# EAGLE schematic BEP33_2panel_v2b_DESKTOP-T8KKGMJ_Mai-19-014526-2018_Conflict (EAGLE 7.7.0)
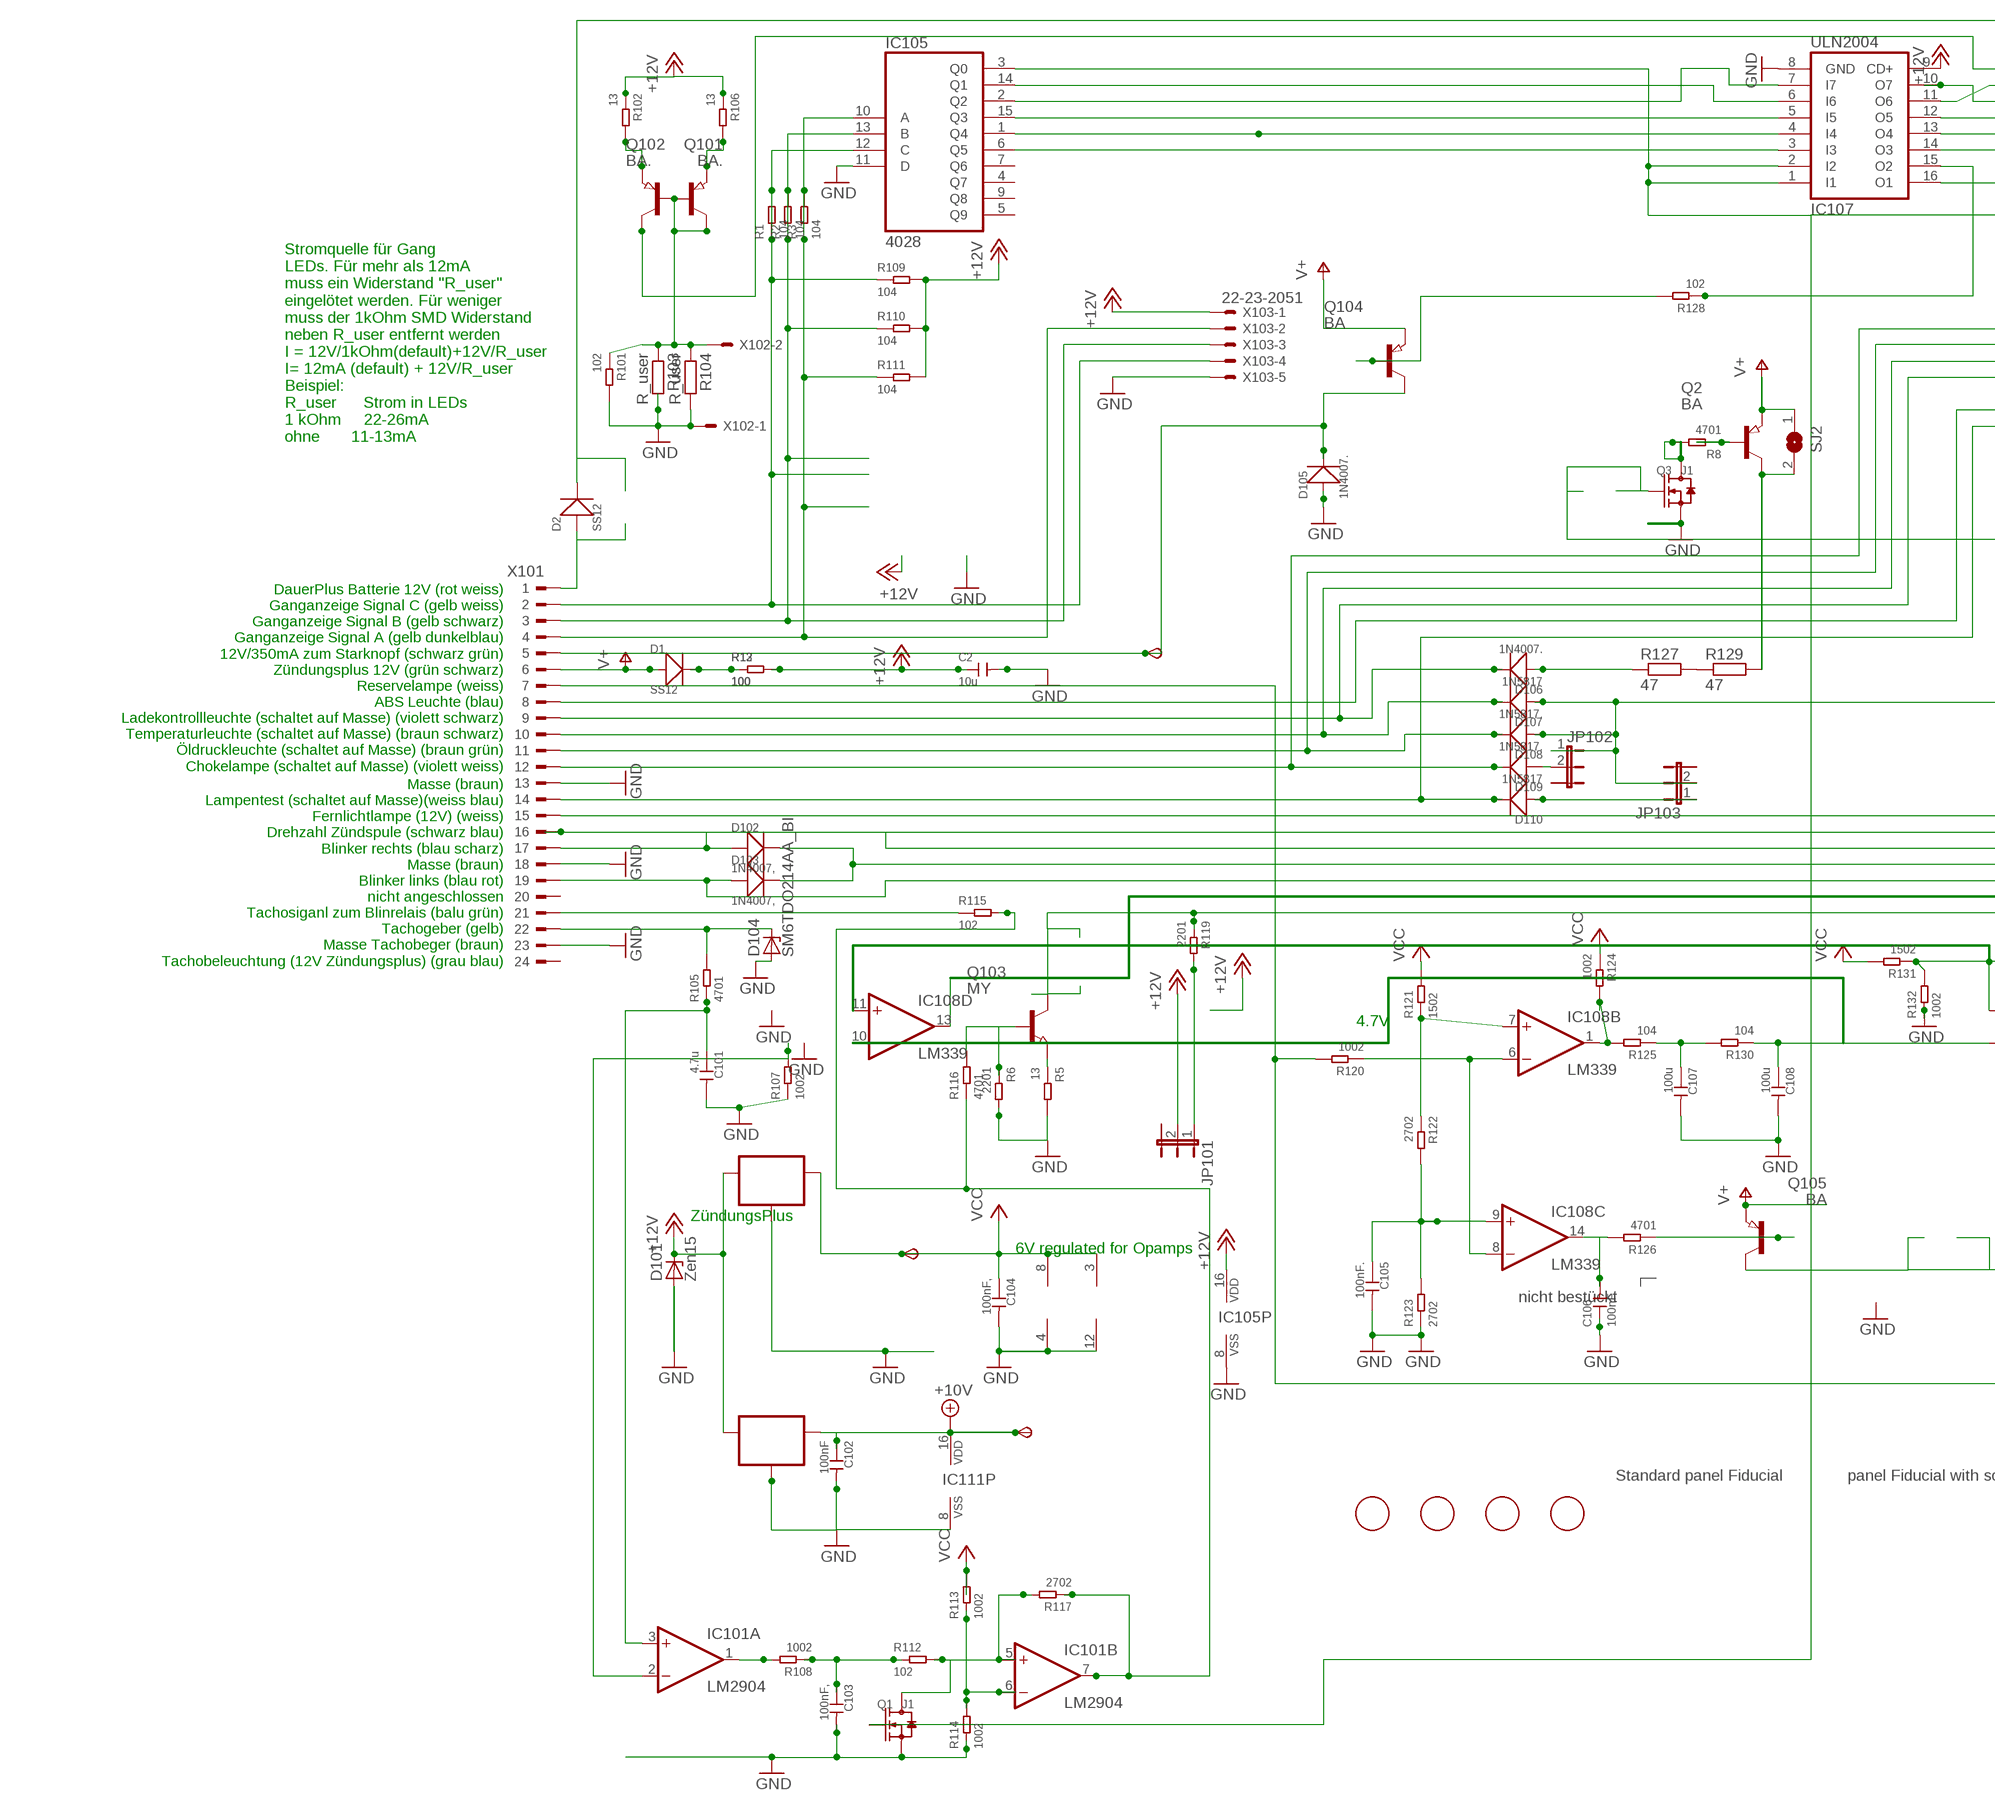
[diagram p0: schematic, sheet 1, part 1 of 2]
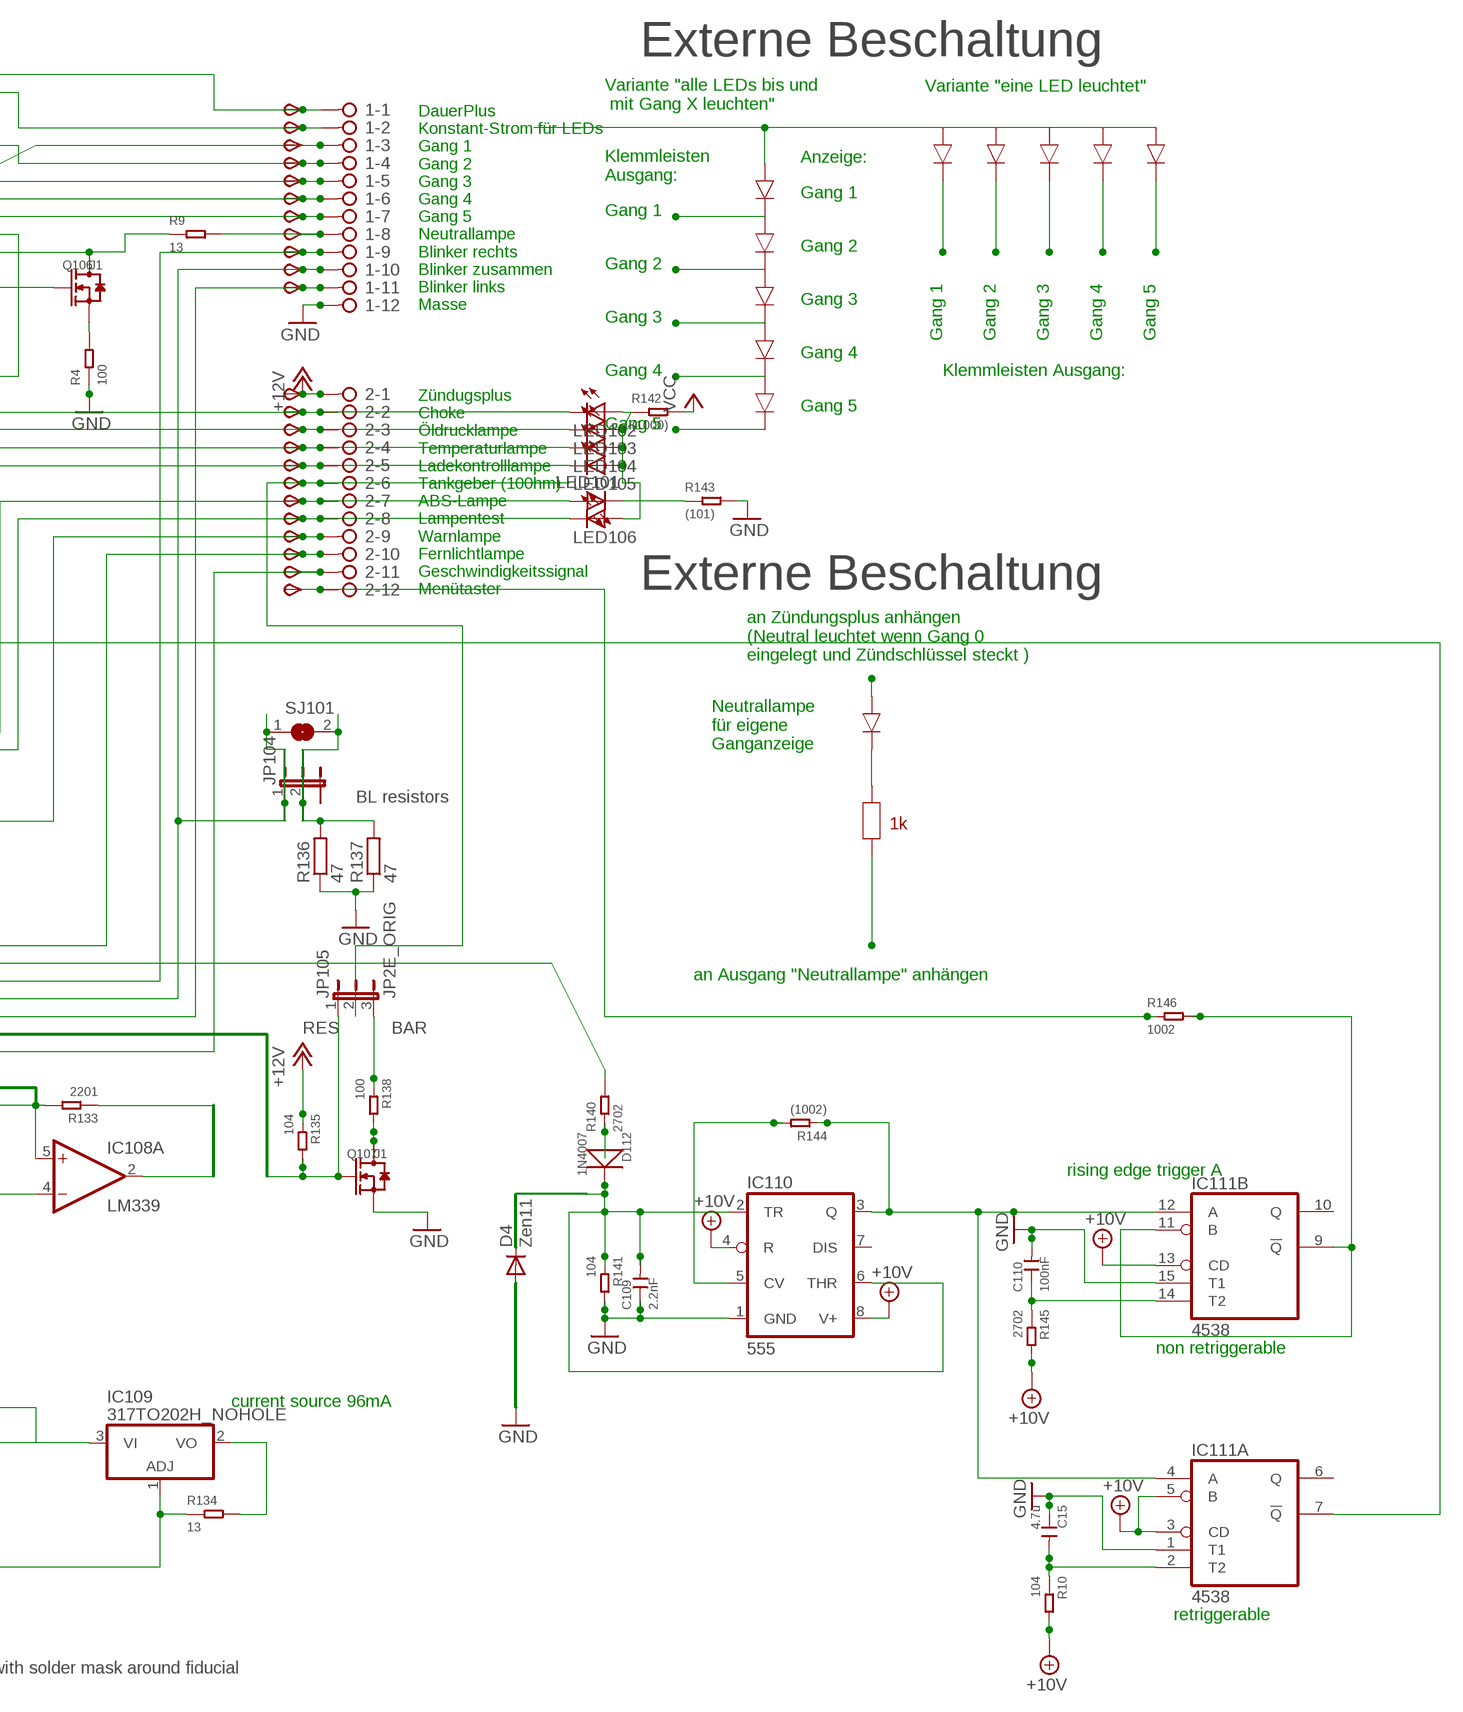
[diagram p1: schematic, sheet 1, part 2 of 2]

## Parts
1  2081-1132  [12-PIN]
2  2081-1132  [12-PIN]
6V  TPSB2.0  [B2.0]
10V  TPSB2.0  [B2.0]
C2  10u  CERAMIC-100UF-6.3V-20%-X5R(1206)  [C1206]
C15  4.7u  CERAMIC-4.7UF-25V-10%-X5R(0805)  [C0805]
C101  4.7u  CERAMIC-4.7UF-25V-10%-X5R(0805)  [C0805]
C102  100nF  CERAMIC-100NF-50V-10%-X7R(0805)  [C0805]
C103  100nF,  CERAMIC-100NF-50V-10%-X7R(0805)  [C0805]
C104  100nF,  CERAMIC-100NF-50V-10%-X7R(0805)  [C0805]
C105  100nF.  CERAMIC-100NF-50V-10%-X7R(0805)  [C0805]
C106  100nF.  CERAMIC-100NF-50V-10%-X7R(0805)  [C0805]
C107  100u  CERAMIC-100UF-6.3V-20%-X5R(1206)  [C1206]
C108  100u  CERAMIC-100UF-6.3V-20%-X5R(1206)  [C1206]
C109  2.2nF  CERAMIC-100NF-50V-10%-X7R(0805)  [C0805]
C110  100nF  CERAMIC-100NF-50V-10%-X7R(0805)  [C0805]
D1  SS12  DIODE-GEN-PURPOSE-1KV-1A(DO-214AC)DO-214AC/1206  [DO-214AC_SLIM]
D2  SS12  DIODE-GEN-PURPOSE-1KV-1A(DO-214AC)DO-214AC/1206  [DO-214AC_SLIM]
D4  Zen11  CGRM4001-G  [SOD-123_MINI-SMA]
D101  Zen15  SM6T  [DO214AA]
D102  1N4007,  DIODE-GEN-PURPOSE-1KV-1A(DO-214AC)  [DO-214AC]
D103  1N4007,  DIODE-GEN-PURPOSE-1KV-1A(DO-214AC)  [DO-214AC]
D104  SM6TDO214AA_BI  [DO214AA_BI]
D105  1N4007.  DIODE-GEN-PURPOSE-1KV-1A(DO-214AC)  [DO-214AC]
D106  1N4007.  DIODE-GEN-PURPOSE-1KV-1A(DO-214AC)  [DO-214AC]
D107  1N5817  DIODE-GEN-PURPOSE-1KV-1A(DO-214AC)DO-214AC/1206  [DO-214AC_SLIM]
D108  1N5817.  DIODE-GEN-PURPOSE-1KV-1A(DO-214AC)DO-214AC/1206  [DO-214AC_SLIM]
D109  1N5817.  DIODE-GEN-PURPOSE-1KV-1A(DO-214AC)DO-214AC/1206  [DO-214AC_SLIM]
D110  1N5817  DIODE-GEN-PURPOSE-1KV-1A(DO-214AC)DO-214AC/1206  [DO-214AC_SLIM]
D112  1N4007  DIODE-GEN-PURPOSE-1KV-1A(DO-214AC)  [DO-214AC]
FID101  FIDUCIAL  [FIDUCIAL_1MM]
FID102  FIDUCIAL  [FIDUCIAL_1MM]
FID103  FIDUCIAL  [FIDUCIAL_1MM]
FID104  FIDUCIAL  [FIDUCIAL_1MM]
IC101  LM2904  LM358D  [SO08]
IC102  78L06  78LXXSOT89_ROUND  [SOT89_ROUND]
IC104  78L10  78LXXSOT89_ROUND  [SOT89_ROUND]
IC105  4028  4028D  [SO16]
IC107  ULN2004  ULN2004AD  [SO16]
IC108  LM339  LM339D  [SO14]
IC109  317TO202H_NOHOLE  [TO220H_NOHOLE]
IC110  555  NE555D  [SO08]
IC111  4538  4538D  [SO16]
JP101  JP2EJP2_SMALLPADS  [JP2_SMALLPADS]
JP102  JP2EJP2_SMALLPADS  [JP2_SMALLPADS]
JP103  JP2EJP2_SMALLPADS  [JP2_SMALLPADS]
JP104  JP2EJP2_SMALLPADS  [JP2_SMALLPADS]
JP105  JP2E_ORIG  [JP2_ORIG_SMALLPADS]
LED101  LEDLD260  [LD260]
LED102  LEDLD260  [LD260]
LED103  LEDLD260  [LD260]
LED104  LEDLD260  [LD260]
LED105  LEDLD260  [LD260]
LED106  LEDLD260  [LD260]
Q1  J1  SMD-MOSFET-N-CH-50V-200MA-BSS138W-7-F(SOT-23)  [SOT-23]
Q2  BA  PNP-TRANSISTOR_SOT89  [SOT89]
Q3  J1  SMD-MOSFET-N-CH-50V-200MA-BSS138W-7-F(SOT-23)  [SOT-23]
Q101  BA.  PNP-TRANSISTOR_SOT89  [SOT89]
Q102  BA.  PNP-TRANSISTOR_SOT89  [SOT89]
Q103  MY  NPN-TRANSISTOR_SOT89  [SOT89]
Q104  BA  PNP-TRANSISTOR_SOT89  [SOT89]
Q105  BA  PNP-TRANSISTOR_SOT89  [SOT89]
Q106  J1  SMD-MOSFET-N-CH-50V-200MA-BSS138W-7-F(SOT-23)  [SOT-23]
Q107  J1  SMD-MOSFET-N-CH-50V-200MA-BSS138W-7-F(SOT-23)  [SOT-23]
R1  104  SMD-RES-10K-1%-1/8W(0805)  [R0805]
R2  104  SMD-RES-10K-1%-1/8W(0805)  [R0805]
R3  104  SMD-RES-10K-1%-1/8W(0805)  [R0805]
R4  100  SMD-RES-220R-5%-1/8W(0805)  [R0805]
R5  13  SMD-RES-13R-5%-1/4W(1206)  [R1206]
R6  2201  SMD-RES-1K-5%-1/8W(0805)  [R0805]
R8  4701  SMD-RES-4.7K-5%-1/8W(0805)  [R0805]
R9  13  SMD-RES-13R-5%-1/4W(1206)  [R1206]
R10  104  SMD-RES-4.7K-5%-1/8W(0805)  [R0805]
R12  100  SMD-RES-2.2K-5%-1/8W(0805)  [R0805]
R13  100  SMD-RES-2.2K-5%-1/8W(0805)  [R0805]
R101  102  SMD-RES-1K-5%-1/8W(0805)  [R0805]
R102  13  SMD-RES-13R-5%-1/4W(1206)  [R1206]
R103  R_user  R-EU_R0805  [R0805]
R104  R_user  R-EU_R0805  [R0805]
R105  4701  SMD-RES-4.7K-5%-1/8W(0805)  [R0805]
R106  13  SMD-RES-13R-5%-1/4W(1206)  [R1206]
R107  1002  SMD-RES-10K-1%-1/8W(0805)  [R0805]
R108  1002  SMD-RES-10K-1%-1/8W(0805)  [R0805]
R109  104  SMD-RES-10K-1%-1/8W(0805)  [R0805]
R110  104  SMD-RES-10K-1%-1/8W(0805)  [R0805]
R111  104  SMD-RES-10K-1%-1/8W(0805)  [R0805]
R112  102  SMD-RES-1K-5%-1/8W(0805)  [R0805]
R113  1002  SMD-RES-1K-5%-1/8W(0805)  [R0805]
R114  1002  SMD-RES-1K-5%-1/8W(0805)  [R0805]
R115  102  SMD-RES-220R-5%-1/8W(0805)  [R0805]
R116  4701  SMD-RES-4.7K-5%-1/8W(0805)  [R0805]
R117  2702  SMD-RES-4.7K-5%-1/8W(0805)  [R0805]
R119  2201  SMD-RES-2.2K-5%-1/8W(0805)  [R0805]
R120  1002  SMD-RES-10K-1%-1/8W(0805)  [R0805]
R121  1502  SMD-RES-10K-1%-1/8W(0805)  [R0805]
R122  2702  SMD-RES-4.7K-5%-1/8W(0805)  [R0805]
R123  2702  SMD-RES-4.7K-5%-1/8W(0805)  [R0805]
R124  1002  SMD-RES-10K-1%-1/8W(0805)  [R0805]
R125  104  SMD-RES-10K-1%-1/8W(0805)  [R0805]
R126  4701  SMD-RES-4.7K-5%-1/8W(0805)  [R0805]
R127  47  R-EU_V235/17_1MM  [V235/17_1MM]
R128  102  SMD-RES-1K-5%-1/8W(0805)  [R0805]
R129  47  R-EU_V235/17_1MM  [V235/17_1MM]
R130  104  SMD-RES-10K-1%-1/8W(0805)  [R0805]
R131  1502  SMD-RES-10K-1%-1/8W(0805)  [R0805]
R132  1002  SMD-RES-10K-1%-1/8W(0805)  [R0805]
R133  2201  SMD-RES-2.2K-5%-1/8W(0805)  [R0805]
R134  13  SMD-RES-13R-5%-1/4W(1206)  [R1206]
R135  104  SMD-RES-10K-1%-1/8W(0805)  [R0805]
R136  47  R-EU_V235/17_1MM  [V235/17_1MM]
R137  47  R-EU_V235/17_1MM  [V235/17_1MM]
R138  100  SMD-RES-2.2K-5%-1/8W(0805)  [R0805]
R140  2702  SMD-RES-10K-1%-1/8W(0805)  [R0805]
R141  104  SMD-RES-10K-1%-1/8W(0805)  [R0805]
R142  (1000)  SMD-RES-100R-5%-1/8W(0805)  [R0805]
R143  (101)  SMD-RES-100R-5%-1/8W(0805)  [R0805]
R144  (1002)  SMD-RES-10K-1%-1/8W(0805)  [R0805]
R145  2702  SMD-RES-4.7K-5%-1/8W(0805)  [R0805]
R146  1002  SMD-RES-4.7K-5%-1/8W(0805)  [R0805]
SJ2  SJ  [SJ]
SJ101  SJ  [SJ]
START  TPSB2.0  [B2.0]
TP1  TPSB2.0  [B2.0]
TP2  TPSB2.0  [B2.0]
TP3  TPSB2.0  [B2.0]
TP4  TPSB2.0  [B2.0]
TP5  TPSB2.0  [B2.0]
TP6  TPSB2.0  [B2.0]
TP7  TPSB2.0  [B2.0]
TP8  TPSB2.0  [B2.0]
TP9  TPSB2.0  [B2.0]
TP10  TPSB2.0  [B2.0]
TP11  TPSB2.0  [B2.0]
TP12  TPSB2.0  [B2.0]
TP13  TPSB2.0  [B2.0]
TP16  TPSB2.0  [B2.0]
TP17  TPSB2.0  [B2.0]
TP18  TPSB2.0  [B2.0]
TP19  TPSB2.0  [B2.0]
TP21  TPSB2.0  [B2.0]
TP22  TPSB2.0  [B2.0]
TP23  TPSB2.0  [B2.0]
TP24  TPSB1,27  [B1,27]
TP25  TPSB2.0  [B2.0]
TP26  TPSB2.0  [B2.0]
X101  CON_BMWV2  [24-PIN_V2]
X102  22-23-2021  [22-23-2021]
X103  22-23-2051  [22-23-2051]

## Nets
+10V: 10V.TP(PP) C102.1 IC104.1(OUT) IC110.4(R) IC110.8(V+) IC111.3(A:CD) IC111.5(A:B) IC111.13(B:CD) IC111.16(P:VDD) R10.2 R145.2
+12V: 2.1 C2.1 D101.C IC102.3(IN) IC104.3(IN) IC105.16(VDD) IC107.9(CD+) JP101.2 R12.2 R13.2 R102.1 R106.1 R109.2 R110.2 R111.2 R135.1 TP12.TP(PP) X103.1
+12V1: 2.11 Q103.2(C) R119.1 TP26.TP(PP)
GND: 1.12 C2.2 C15.1 C101.2 C102.2 C103.2 C104.2 C105.2 C106.1 C107.2 C108.2 C109.1 C110.2 D4.A D101.A D104.A D105.1(+) IC101.4(P:V-) IC102.2(GND) IC102.2@1(GND) IC104.2(GND) IC104.2@1(GND) IC105.8(VSS) IC105.11(D) IC107.8(GND) IC108.12(P:GND) IC110.1(GND) IC111.1(A:T1) IC111.8(P:VSS) IC111.15(B:T1) Q1.2(S) Q3.2(S) Q107.2(S) R4.1 R5.2 R6.2 R101.2 R103.2 R104.2 R107.1 R114.1 R123.1 R132.1 R136.1 R137.1 R141.2 R143.2 X101.13 X101.18 X101.23 X102.1 X103.5
N$1: 2.9 D107.1(+) D108.1(+) JP102.1 JP103.2 TP24.TP(PP)
N$2: IC105.10(A) R3.1 R3.2 R111.1 X101.4 X103.2
N$3: IC105.13(B) R2.1 R2.2 R110.1 X101.3 X103.3
N$4: 2.7 LED101.A TP22.TP(PP) X101.8
N$5: Q101.3(E) R102.2
N$6: Q2.1(B) R8.1
N$7: IC101.2(A:-IN) R107.2
N$8: R127.2 R129.1
N$9: Q102.3(E) R106.2
N$11: D105.2(-) Q104.2(C) START.TP(PP) X101.5
N$12: 2.2 D109.2(-) LED102.K(C) TP16.TP(PP) X101.12
N$13: 2.3 D108.2(-) LED103.K(C) TP17.TP(PP) X101.11
N$14: 2.4 D107.2(-) LED104.K(C) TP18.TP(PP) X101.10
N$15: IC109.3(VI) Q105.2(C)
N$16: IC108.6(B:-IN) IC108.8(C:-IN) R120.1
N$17: IC105.12(C) R1.1 R1.2 R109.1 X101.2 X103.4
N$18: IC105.15(Q3) IC107.5(I5)
N$19: 2.8 D110.2(-) LED106.K(C) TP23.TP(PP) X101.14
N$20: 1.9 D102.1(+) TP9.TP(PP) X101.17
N$21: 1.11 D103.1(+) TP11.TP(PP) X101.19
N$22: IC111.9(B:!Q) IC111.11(B:B) R146.2
N$23: D104.C R105.2 X101.22
N$24: C101.1 IC101.3(A:+IN) R105.1
N$25: 1.6 IC107.13(O4) TP6.TP(PP)
N$26: 1.7 IC107.14(O3) TP7.TP(PP)
N$27: D1.2(-) R12.1 R13.1
N$28: 2.6 JP105.2 TP21.TP(PP)
N$29: JP101.1 R119.2
N$30: C105.1 IC108.9(C:+IN) R122.2 R123.2
N$31: C106.2 IC108.14(C:OUT) R126.2
N$32: Q3.3(D) R8.2
N$34: LED101.K(C) R143.1
N$35: IC109.1(ADJ) R120.2 R134.1 X101.7
N$36: Q105.1(B) R126.1
N$37: IC105.2(Q2) IC107.7(I7)
N$38: 1.3 IC107.11(O6) TP3.TP(PP)
N$39: 1.5 IC107.12(O5) TP5.TP(PP)
N$41: LED102.A LED103.A LED104.A LED105.A LED106.A R142.1
N$42: R140.2 X101.16
N$43: Q104.1(B) R128.2
N$44: IC105.3(Q0) IC107.1(I1) IC107.2(I2) Q1.1(G) Q106.1(G)
N$45: C107.1 R125.1 R130.2
N$46: C108.1 IC108.4(A:-IN) IC108.10(D:-IN) R130.1
N$47: IC108.5(A:+IN) IC108.11(D:+IN) R131.1 R132.2 R133.2
N$48: Q107.3(D) R138.2
N$49: IC111.7(A:!Q) Q3.1(G)
N$50: IC105.1(Q4) IC107.4(I4)
N$51: R115.1 X101.21
N$52: IC107.16(O1) Q106.3(D) R9.1
N$53: 2.10 TP25.TP(PP) X101.15
N$54: D106.1(+) R127.1
N$55: 2.5 D106.2(-) LED105.K(C) TP19.TP(PP) X101.9
N$56: IC105.14(Q1) IC107.6(I6)
N$57: Q101.1(B) Q102.1(B) Q102.2(C) R101.1 R103.1 R104.1 X102.2
N$58: 1.8 R9.2 TP8.TP(PP)
N$59: 1.2 Q101.2(C) TP2.TP(PP)
N$60: IC108.13(D:OUT) JP105.1 Q107.1(G) R135.2
N$61: IC105.6(Q5) IC107.3(I3)
N$64: IC109.2(VO) R134.2
N$65: IC110.5(CV) R144.2
N$67: 1.4 IC107.10(O7) TP4.TP(PP)
N$69: 1.1 D2.2(-) TP1.TP(PP)
N$83: IC108.7(B:+IN) R121.1 R122.1
N$84: Q106.2(S) R4.2
N$85: Q103.1(B) R6.1 R116.2
N$86: IC110.3(Q) IC111.4(A:A) IC111.12(B:A) R144.1
N$87: D112.1(+) R140.1
N$88: IC107.15(O2) R128.1
N$89: C110.1 IC111.14(B:T2) R145.1
N$90: 2.12 R146.1 TP13.TP(PP)
N$91: D2.1(+) X101.1
N$92: IC101.1(A:OUT) R108.2
N$93: 1.10 D102.2(-) D103.2(-) JP104.1 SJ101.1 TP10.TP(PP)
N$94: JP104.2 R136.2 R137.2 SJ101.2
N$95: D109.1(+) JP102.2
N$96: C103.1 R108.1 R112.1
N$97: IC101.5(B:+IN) Q1.3(D) R112.2 R117.2
N$98: D110.1(+) JP103.1
N$99: JP105.3 R138.1
N$100: Q103.3(E) R5.1
N$101: IC101.6(B:-IN) R113.1 R114.2
N$102: C109.2 D4.C D112.2(-) IC110.2(TR) IC110.6(THR) R141.1
N$103: C15.2 IC111.2(A:T2) R10.1
N$104: Q2.2(C) R129.2 SJ2.2
N$107: IC101.7(B:OUT) R115.2 R116.1 R117.1
N$108: IC108.2(A:OUT) R133.1
N$580: IC108.1(B:OUT) R124.2 R125.2
V+: D1.1(+) Q2.3(E) Q104.3(E) Q105.3(E) SJ2.1 X101.6
VCC: 6V.TP(PP) C104.1 IC101.8(P:V+) IC102.1(OUT) IC108.3(P:V+) R113.2 R121.2 R124.1 R131.2 R142.2
Unconnected: IC105.4(Q7) IC105.5(Q9) IC105.7(Q6) IC105.9(Q8) IC110.7(DIS) IC111.6(A:Q) IC111.10(B:Q) X101.20 X101.24

## Notes on the sheet
- Externe Beschaltung
- Variante "eine LED leuchtet"
- Variante "alle LEDs bis und
   mit Gang X leuchten"
- Anzeige:
- Klemmleisten
  Ausgang:
- Gang 1
- DauerPlus
  Konstant-Strom für LEDs
  Gang 1
  Gang 2
  Gang 3
  Gang 4
  Gang 5
  Neutrallampe
  Blinker rechts
  Blinker zusammen
  Blinker links
  Masse
- Gang 1
- Gang 2
- Gang 2
- Gang 3
- Gang 3
- Gang 1 | Gang 2 | Gang 3 | Gang 4 | Gang 5
- Gang 4
- Gang 4 | Klemmleisten Ausgang:
- Gang 5
- Gang 5
- Zündugsplus
  Choke
  Öldrucklampe
  Temperaturlampe
  Ladekontrolllampe
  Tankgeber (100hm)
  ABS-Lampe
  Lampentest
  Warnlampe
  Fernlichtlampe
  Geschwindigkeitssignal
  Menütaster
- Stromquelle für Gang
  LEDs. Für mehr als 12mA
  muss ein Widerstand "R_user"
  eingelötet werden. Für weniger
  muss der 1kOhm SMD Widerstand
  neben R_user entfernt werden
  I = 12V/1kOhm(default)+12V/R_user
  I= 12mA (default) + 12V/R_user
  Beispiel:
  R_user      Strom in LEDs
  1 kOhm     22-26mA
  ohne       11-13mA
- Externe Beschaltung
- an Zündungsplus anhängen
  (Neutral leuchtet wenn Gang 0
  eingelegt und Zündschlüssel steckt )
- Neutrallampe
  für eigene
  Ganganzeige
- DauerPlus Batterie 12V (rot weiss)
  Ganganzeige Signal C (gelb weiss)
  Ganganzeige Signal B (gelb schwarz)
  Ganganzeige Signal A (gelb dunkelblau)
  12V/350mA zum Starknopf (schwarz grün)
  Zündungsplus 12V (grün schwarz)
  Reservelampe (weiss)
  ABS Leuchte (blau)
  Ladekontrollleuchte (schaltet auf Masse) (violett schwarz)
  Temperaturleuchte (schaltet auf Masse) (braun schwarz)
  Öldruckleuchte (schaltet auf Masse) (braun grün)
  Chokelampe (schaltet auf Masse) (violett weiss)
- BL resistors
- 1k
- an Ausgang "Neutrallampe" anhängen
- Masse (braun)
  Lampentest (schaltet auf Masse)(weiss blau)
  Fernlichtlampe (12V) (weiss)
  Drehzahl Zündspule (schwarz blau)
  Blinker rechts (blau scharz)
  Masse (braun)
  Blinker links (blau rot)
  nicht angeschlossen
  Tachosiganl zum Blinrelais (balu grün)
  Tachogeber (gelb)
  Masse Tachobeger (braun)
  Tachobeleuchtung (12V Zündungsplus) (grau blau)
- RES | BAR
- 4.7V | rising edge trigger A
- non retriggerable
- ZündungsPlus
- current source 96mA
- 6V regulated for Opamps
- nicht bestückt
- retriggerable
- Standard panel Fiducial | panel Fiducial with solder mask around fiducial

## Library data of the parts
1 2 = con WAGO BMW:2081-1132: WAGO SREW CLAMP
6V 10V START TP1-TP13 TP16-TP19 TP21-TP26 = testpin_BMW:TPS: TEST PIN
C2 C107 C108 = Seeed-Capacitor-2016:CERAMIC-100UF-6.3V-20%-X5R(1206): 302010183; MPN: GRM31CR60J107ME39L; VALUE: 100uf
C15 C101 = Seeed-Capacitor-2016:CERAMIC-4.7UF-25V-10%-X5R(0805): 302010146; MPN: CC0805KKX5R8BB475; VALUE: 4.7uf
C102-C106 C109 C110 = Seeed-Capacitor-2016:CERAMIC-100NF-50V-10%-X7R(0805): 302010165; MPN: CC0805KRX7R9BB104; VALUE: 100nf
D1 D2 D107-D110 = Diode-do214ac:DIODE-GEN-PURPOSE-1KV-1A(DO-214AC): 304010013
D4 = diode:CGRM400*-G: Molded plasitc,JEDEC SOD-123/Mini SMA Source: Comchip CGRM4001-G.pdf
D101 D104 = Suppressor_Diode_DO214AA:SM6T: Z DIODE
D102 D103 D105 D106 = Diode-do214ac:DIODE-GEN-PURPOSE-1KV-1A(DO-214AC): 304010013; MPN: 1N4007; VALUE: 1N4007
D112 = Diode-do214ac:DIODE-GEN-PURPOSE-1KV-1A(DO-214AC): 304010013; MPN: 1N4007
FID101-FID104 = Fiducial:FIDUCIAL: For use by pick and place machines to calibrate the vision/machine, 1mm By microbuilder.eu
IC101 = linear_BMW:LM358: OP AMP also LM158; LM258; LM2904 Source: http://cache.national.com/ds/LM/LM158.pdf
IC102 IC104 = 78LXX:78LXX
IC105 = 4028:4028: BCD to decimal DECODER
IC107 = uln-udn:ULN2004A: DRIVER ARRAY
IC108 = LM339:LM339: Low Power Low Offset Voltage Quad Comparators with open collector; LM139/LM239/LM339/LM2901/LM3302
IC109 = linear_BMW:*317: Positive VOLTAGE REGULATOR
IC110 = linear:*555: TIMER
IC111 = 45xx:4538: Dual precision monostable MULTIVIBRATOR
JP101-JP104 = Switch Aliexpress 2:JP2E: JUMPER
JP105 = Switch Aliexpress 2:JP2E_ORIG
LED101-LED106 = led:LED: LED OSRAM: - CHIPLED LG R971, LG N971, LY N971, LG Q971, LY Q971, LO R971, LY R971 LH N974, LH R974 LS Q976, LO Q976, LY Q976 LO Q996 - Hyper CHIPLED LW Q18S LB Q993, LB Q99A, LB R99A - SideLED LS A670, LO A670, LY A670, LG A670, LP A670 LB A673, LV A673, LT A673, LW A673 LH A674 LY A675 LS A676, LA A676, LO A676, LY A676, LW A676 LS A679, LY A679, LG A679 - Hyper Micro SIDELED® LS Y876, LA Y876, LO Y876, LY Y876 LT Y87S - SmartLED LW L88C, LW L88S LB L89C, LB L89S, LG L890 LS L89K, LO L89K, LY L89K LS L896, LA L896, LO L896, LY L896 - TOPLED LS T670, LO T670, LY T670, LG T670, LP T670 LSG T670, LSP T670, LSY T670, LOP T670, LYG T670 LG T671, LOG T671, LSG T671 LB T673, LV T673, LT T673, LW T673 LH T674 LS T676, LA T676, LO T676, LY T676, LB T676, LH T676, LSB T676, LW T676 LB T67C, LV T67C, LT T67C, LS T67K, LO T67K, LY T67K, LW E67C LS E67B, LA E67B, LO E67B, LY E67B, LB E67C, LV E67C, LT E67C LW T67C LS T679, LY T679, LG T679 LS T770, LO T770, LY T770, LG T770, LP T770 LB T773, LV T773, LT T773, LW T773 LH T774 LS E675, LA E675, LY E675, LS T675 LS T776, LA T776, LO T776, LY T776, LB T776 LHGB T686 LT T68C, LB T68C - Hyper Mini TOPLED® LB M676 - Mini TOPLED Santana® LG M470 LS M47K, LO M47K, LY M47K Source: http://www.osram.convergy.de LUXEON: - LUMILED® LXK2-PW12-R00, LXK2-PW12-S00, LXK2-PW14-U00, LXK2-PW14-V00 LXK2-PM12-R00, LXK2-PM12-S00, LXK2-PM14-U00 LXK2-PE12-Q00, LXK2-PE12-R00, LXK2-PE12-S00, LXK2-PE14-T00, LXK2-PE14-U00 LXK2-PB12-K00, LXK2-PB12-L00, LXK2-PB12-M00, LXK2-PB14-N00, LXK2-PB14-P00, LXK2-PB14-Q00 LXK2-PR12-L00, LXK2-PR12-M00, LXK2-PR14-Q00, LXK2-PR14-R00 LXK2-PD12-Q00, LXK2-PD12-R00, LXK2-PD12-S00 LXK2-PH12-R00, LXK2-PH12-S00 LXK2-PL12-P00, LXK2-PL12-Q00, LXK2-PL12-R00 Source: www.luxeon.com KINGBRIGHT: KA-3528ASYC Source: www.kingbright.com
Q1 Q3 Q106 Q107 = Seeed-Transistor-2016:SMD-MOSFET-N-CH-50V-200MA-BSS138W-7-F(SOT-23): 305030000; MPN: BSS138W-7-F; VALUE: BSS138W-7-F
Q2 Q101 Q102 Q104 Q105 = Transistor_SOT89:PNP-TRANSISTOR_: PNP TRANSISTOR
Q103 = Transistor_SOT89:NPN-TRANSISTOR_: NPN TRANSISTOR
R1-R3 R107-R111 R120 R121 R124 R125 R130-R132 R135 R140 R141 R144 = Seeed-Resistor-2016:SMD-RES-10K-1%-1/8W(0805): 301010361; MPN: RC0805FR-0710KL; VALUE: 10K
R4 R115 = Seeed-Resistor-2016:SMD-RES-220R-5%-1/8W(0805): 301010315; MPN: RC0805JR-07220RL; VALUE: 220R
R5 R9 R102 R106 R134 = Seeed-Resistor-2016:SMD-RES-13R-5%-1/4W(1206): 301010405; MPN: RC1206JR-0713RL; VALUE: 13R
R6 R101 R112-R114 R128 = Seeed-Resistor-2016:SMD-RES-1K-5%-1/8W(0805): 301010311; MPN: RC0805JR-071KL; VALUE: 1K
R8 R10 R105 R116 R117 R122 R123 R126 R145 R146 = Seeed-Resistor-2016:SMD-RES-4.7K-5%-1/8W(0805): 301010306; MPN: RC0805JR-074K7L; VALUE: 4.7K
R12 R13 R119 R133 R138 = Seeed-Resistor-2016:SMD-RES-2.2K-5%-1/8W(0805): 301010333; MPN: RC0805JR-072K2L; VALUE: 2.2K
R103 R104 R127 R129 R136 R137 = rcl:R-EU_: RESISTOR, European symbol
R142 R143 = Seeed-Resistor-2016:SMD-RES-100R-5%-1/8W(0805): 301010319; MPN: RC0805JR-07100RL; VALUE: 100R
SJ2 = jumper:SJ: SMD solder JUMPER
SJ101 = solder-jumper:SJ: SMD solder JUMPER
X101 = con_BMW:CON_BMW: BMW CONNECTOR
X102 = con_Molex_BMW:22-23-2021: .100" (2.54mm) Center Header - 2 Pin; MF: MOLEX; MPN: 22-23-2021; OC_FARNELL: 1462926; OC_NEWARK: 25C3832
X103 = con_Molex_BMW:22-23-2051: .100" (2.54mm) Center Header - 5 Pin; MF: MOLEX; MPN: 22-23-2051; OC_FARNELL: 1462952; OC_NEWARK: 38C9178